# Altium project PM3_Bosclone.PrjPcb
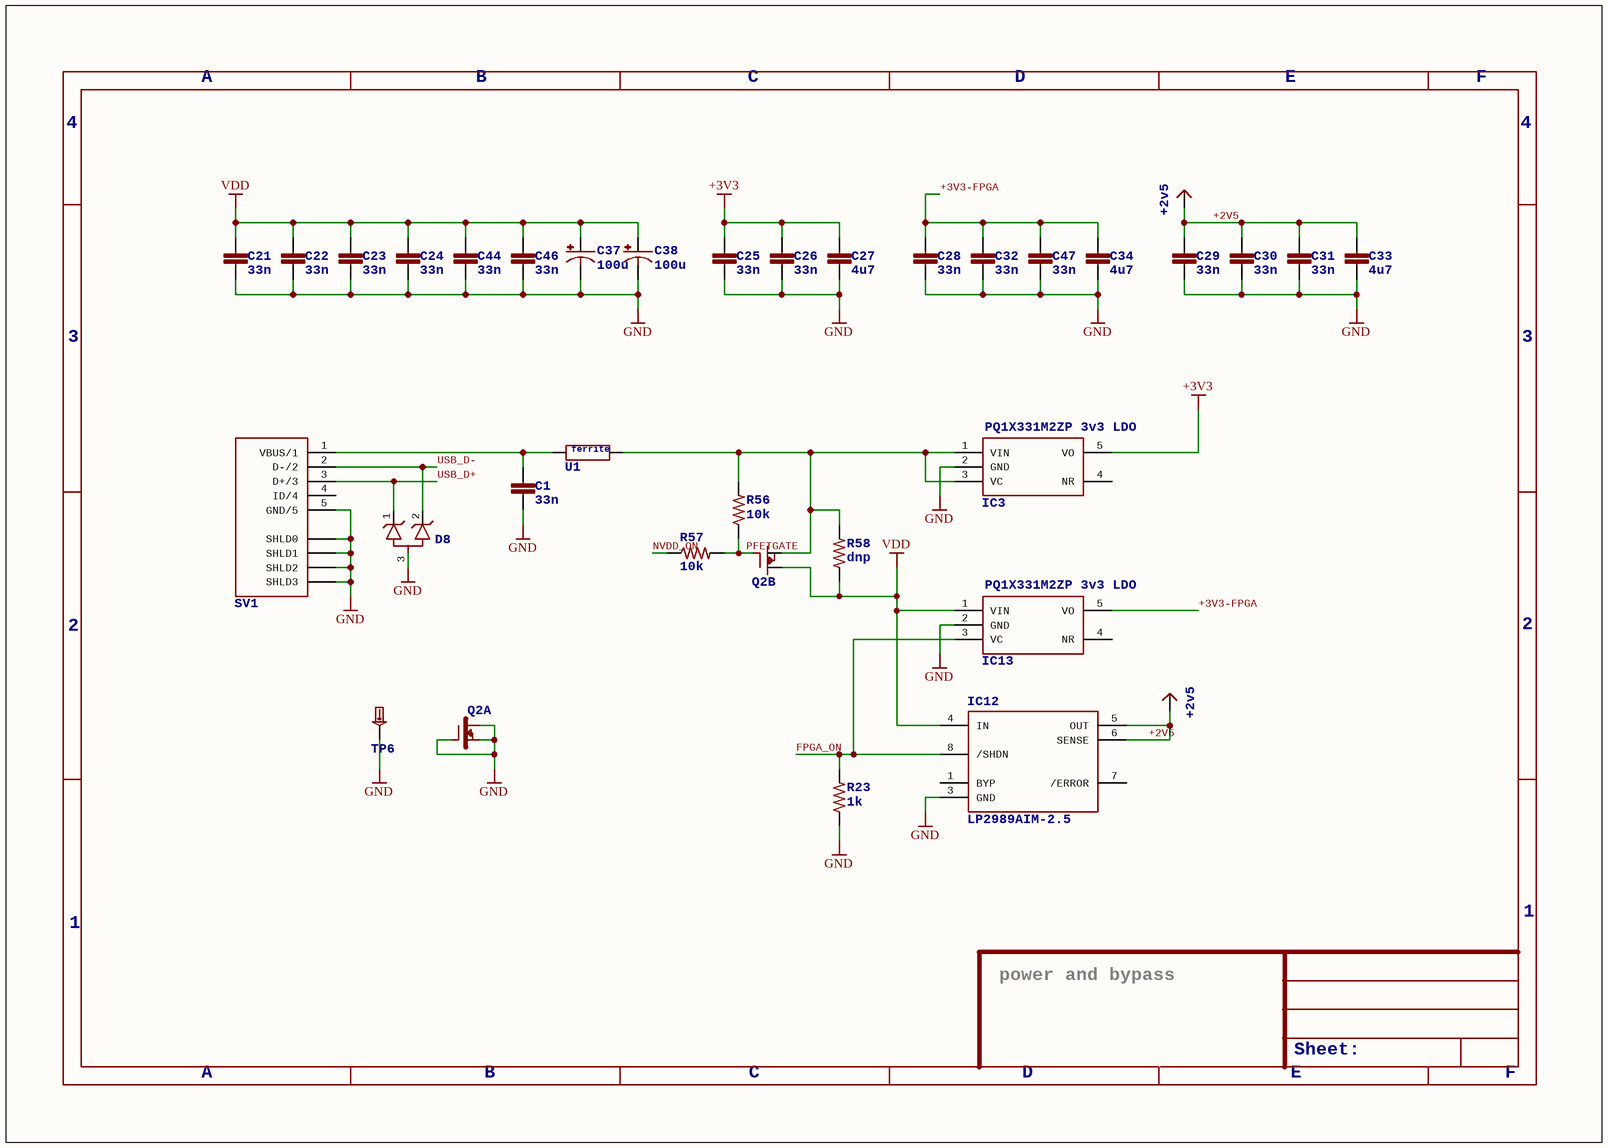
[diagram p0: PM3_Bosclone_PWR_0.SchDoc]
6 sheets, 160 parts. Net scope: global (net labels, ports and power ports of the same name join across sheets).
Board file: PM3_Boscloner.PcbDoc
Sheets:
  PM3_Bosclone_PWR_0.SchDoc
  PM3_Bosclone_FPGA_1.SchDoc
  PM3_Bosclone_MCU_2.SchDoc
  PM3_Bosclone_ANALOG_3.SchDoc
  PM3_Bosclone_ANALOG_TX_4.SchDoc
  PM3_Bosclone_Shield.SchDoc

## Sheet PM3_Bosclone_PWR_0.SchDoc
size 282 x 200 mm

### Parts
C1  33n  [RLC_0603]
C21  33n  [RLC_0603]
C22  33n  [RLC_0603]
C23  33n  [RLC_0603]
C24  33n  [RLC_0603]
C25  33n  [RLC_0603]
C26  33n  [RLC_0603]
C27  4u7  [RLC_1210]
C28  33n  [RLC_0603]
C29  33n  [RLC_0603]
C30  33n  [RLC_0603]
C31  33n  [RLC_0603]
C32  33n  [RLC_0603]
C33  4u7  [RLC_1210]
C34  4u7  [RLC_1210]
C37  100u  [CAPCAITOR-ELECTROLYTIC-ALCHIP-MZA-F80]
C38  100u  [CAPCAITOR-ELECTROLYTIC-ALCHIP-MZA-F80]
C44  33n  [RLC_0603]
C46  33n  [RLC_0603]
C47  33n  [RLC_0603]
D8  DUAL-TVS-COMMON-ANODE  [SOT23-3LEAD]  (value not drawn)
IC3  PQ1X331M2ZP3v3LDO: PQ1X331M2ZP 3v3 LDO  [SOT-23-5]  (hidden comment: PQ1X331M2ZP-3V3-LDO-SOT-23-5)
IC12  LP2989AIM-2.5  [SOIC-8]
IC13  PQ1X331M2ZP3v3LDO: PQ1X331M2ZP 3v3 LDO  [SOT-23-5]  (hidden comment: PQ1X331M2ZP-3V3-LDO-SOT-23-5)
Q2  IRF7307  [SOIC-8]  (value not drawn)  (parts A,B of 2)
R23  1k  [RLC_0603]
R56  10k  [RLC_0603]
R57  10k  [RLC_0603]
R58  dnp  [RLC_0603]
SV1  USB-MINIB  [USB-MINIB-SMD]  (value not drawn)
TP6  TESTPADKEYSTONE-PTH  [KEYSTONE-PTH-TESTPOINT-5011]  (value not drawn)
U1  FERRITE0805  [RLC_0805]  (value not drawn)
V31  SUPPLY_2V5  (value not drawn)
V37  SUPPLY_2V5  (value not drawn)

### Nets
+3V3: C25.1 C26.1 C27.1 IC3.5(VO)
GND: C1.2 C21.2 C22.2 C23.2 C24.2 C25.2 C26.2 C27.2 C28.2 C29.2 C30.2 C31.2 C32.2 C33.2 C34.2 C37.- C38.- C44.2 C46.2 C47.2 D8.3(A) IC3.2(GND) IC12.3(GND) IC13.2(GND) Q2.1(S) Q2.2(G) Q2.8(D) R23.1 SV1.5(GND/5) SV1.TAB0(SHLD0) SV1.TAB1(SHLD1) SV1.TAB2(SHLD2) SV1.TAB3(SHLD3) TP6.A(P$1)
VDD: C21.1 C22.1 C23.1 C24.1 C37.+ C38.+ C44.1 C46.1 IC12.4(IN) IC13.1(VIN) Q2.6(D) R58.1
+2V5: C29.1 C30.1 C31.1 C33.1 IC12.5(OUT) IC12.6(SENSE) V31.?1(+2V5) V37.?1(+2V5)
+3V3-FPGA: C28.1 C32.1 C34.1 C47.1 IC13.5(VO)
FPGA_ON: IC12.8(/SHDN) IC13.3(VC) R23.2
NVDD_ON: R57.1
PFETGATE: Q2.4(G) R56.1 R57.2
USB_D+: D8.1(K1) SV1.3(D+/3)
USB_D-: D8.2(K2) SV1.2(D-/2)
NetC1_1: C1.1 SV1.1(VBUS/1) U1.1(A)
NetIC3_1: IC3.1(VIN) IC3.3(VC) Q2.3(S) R56.2 R58.2 U1.2(B)

Not connected (* = marked no-connect by the designer): IC3 4(NR); IC12 1(BYP) 7(/ERROR); IC13 4(NR); SV1 4(ID/4)

### Notes on the sheet
- A
- B
- C
- D
- E
- F
- 4
- 3
- 2
- 1
- power and bypass
- Sheet:

### Library data of the parts
C1 C21-C26 C28-C32 C44 C46 C47 = CAPACITOR0603
C27 C33 C34 = CAPACITOR1210
C37 C38 = CAPACITOR-POLARIZEDALCHIP-MZA-F80
IC12 = LP2989-LDOSOIC
R23 R56-R58 = RESISTOR0603
U1 = FERRITE0805: ferrite: ferrite
V31 V37 = SUPPLY_2V5: +2v5: +2v5

## Sheet PM3_Bosclone_FPGA_1.SchDoc
size 282 x 200 mm
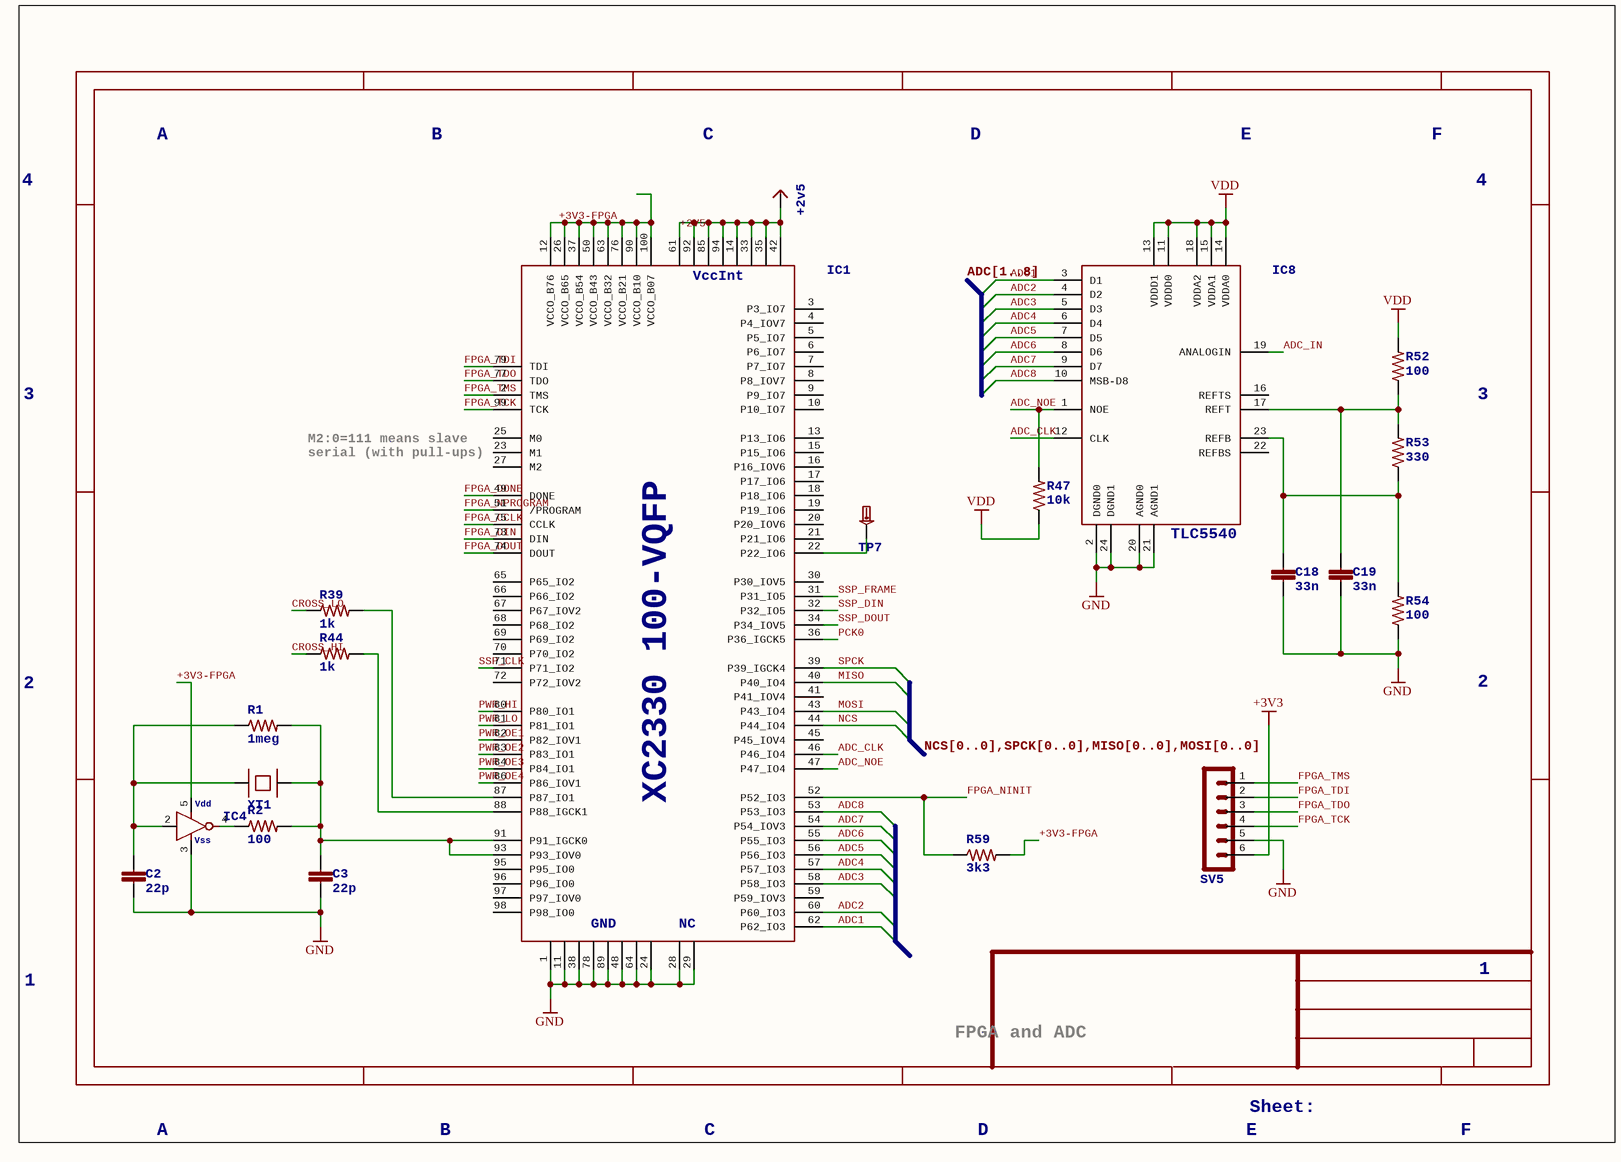
[diagram p1: PM3_Bosclone_FPGA_1.SchDoc]

### Parts
C2  22p  [RLC_0603]
C3  22p  [RLC_0603]
C18  33n  [RLC_0603]
C19  33n  [RLC_0603]
IC1  XC2330100-VQFP: XC2330 100-VQFP  [VQFP-100]  (hidden comment: SPARTAN-II-XC2S30-100-VQFP)
IC4  HCU-INVERTER  [SMV-5]  (value not drawn)
IC8  TLC5540  [TSSOP-24]
R1  1meg  [RLC_0603]
R2  100  [RLC_0603]
R39  1k  [RLC_0603]
R44  1k  [RLC_0603]
R47  10k  [RLC_0603]
R52  100  [RLC_0603]
R53  330  [RLC_0603]
R54  100  [RLC_0603]
R59  3k3  [RLC_0603]
SV5  HEADER-MALE-6X1  [HEADER-MALE-6X1-0.100-UNKEYED]  (value not drawn)
TP7  TESTPADKEYSTONE-SMD  [KEYSTONE-SMD-TESTPOINT-5015]  (value not drawn)
V4  SUPPLY_2V5  (value not drawn)
XT1  XTAL-SMD-CITIZEN-CS10  [XTAL-SMD-CITIZEN-CS10]  (value not drawn)

### Nets
+3V3: SV5.6
GND: C2.2 C3.2 C18.2 C19.2 IC1.1(GND1) IC1.11(GND2) IC1.24(GND8) IC1.28(NC0) IC1.29(NC1) IC1.38(GND3) IC1.48(GND6) IC1.64(GND7) IC1.78(GND4) IC1.89(GND5) IC4.3(VSS) IC8.2(DGND0) IC8.20(AGND0) IC8.21(AGND1) IC8.24(DGND1) R54.1 SV5.5
VDD: IC8.11(VDDD0) IC8.13(VDDD1) IC8.14(VDDA0) IC8.15(VDDA1) IC8.18(VDDA2) R47.1 R52.2
+2V5: IC1.14(VCCINT5) IC1.33(VCCINT6) IC1.35(VCCINT7) IC1.42(VCCINT8) IC1.61(VCCINT1) IC1.85(VCCINT3) IC1.92(VCCINT2) IC1.94(VCCINT4) V4.?1(+2V5)
+3V3-FPGA: IC1.12(VCCO_B76) IC1.26(VCCO_B65) IC1.37(VCCO_B54) IC1.50(VCCO_B43) IC1.63(VCCO_B32) IC1.76(VCCO_B21) IC1.90(VCCO_B10) IC1.100(VCCO_B07) IC4.5(VDD) R59.2
ADC1: IC1.62(P62_IO3) IC8.3(D1)
ADC2: IC1.60(P60_IO3) IC8.4(D2)
ADC3: IC1.58(P58_IO3) IC8.5(D3)
ADC4: IC1.57(P57_IO3) IC8.6(D4)
ADC5: IC1.56(P56_IO3) IC8.7(D5)
ADC6: IC1.55(P55_IO3) IC8.8(D6)
ADC7: IC1.54(P54_IOV3) IC8.9(D7)
ADC8: IC1.53(P53_IO3) IC8.10(MSB-D8)
ADC_CLK: IC1.46(P46_IO4) IC8.12(CLK)
ADC_IN: IC8.19(ANALOGIN)
ADC_NOE: IC1.47(P47_IO4) IC8.1(NOE) R47.2
CROSS_HI: R44.1
CROSS_LO: R39.1
FPGA_CCLK: IC1.75(CCLK)
FPGA_DIN: IC1.73(DIN)
FPGA_DONE: IC1.49(DONE)
FPGA_DOUT: IC1.74(DOUT)
FPGA_NINIT: IC1.52(P52_IO3) R59.1
FPGA_NPROGRAM: IC1.51(/PROGRAM)
FPGA_TCK: IC1.99(TCK) SV5.4
FPGA_TDI: IC1.79(TDI) SV5.2
FPGA_TDO: IC1.77(TDO) SV5.3
FPGA_TMS: IC1.2(TMS) SV5.1
MISO: IC1.40(P40_IO4)
MOSI: IC1.43(P43_IO4)
NCS: IC1.44(P44_IO4)
PCK0: IC1.36(P36_IGCK5)
PWR_HI: IC1.80(P80_IO1)
PWR_LO: IC1.81(P81_IO1)
PWR_OE1: IC1.82(P82_IOV1)
PWR_OE2: IC1.83(P83_IO1)
PWR_OE3: IC1.84(P84_IO1)
PWR_OE4: IC1.86(P86_IOV1)
SPCK: IC1.39(P39_IGCK4)
SSP_CLK: IC1.71(P71_IO2)
SSP_DIN: IC1.32(P32_IO5)
SSP_DOUT: IC1.34(P34_IOV5)
SSP_FRAME: IC1.31(P31_IO5)
NetC2_1: C2.1 IC4.2(A) R1.1 XT1.A
NetC3_1: C3.1 IC1.91(P91_IGCK0) IC1.93(P93_IOV0) R1.2 R2.2 XT1.B
NetC18_1: C18.1 IC8.23(REFB) R53.1 R54.2
NetC19_1: C19.1 IC8.17(REFT) R52.1 R53.2
NetIC1_22: IC1.22(P22_IO6) TP7.1(P$1)
NetIC1_87: IC1.87(P87_IO1) R39.2
NetIC1_88: IC1.88(P88_IGCK1) R44.2
NetIC4_4: IC4.4(Y) R2.1

Not connected (* = marked no-connect by the designer): IC1 3(P3_IO7) 4(P4_IOV7) 5(P5_IO7) 6(P6_IO7) 7(P7_IO7) 8(P8_IOV7) 9(P9_IO7) 10(P10_IO7) 13(P13_IO6) 15(P15_IO6) 16(P16_IOV6) 17(P17_IO6) 18(P18_IO6) 19(P19_IO6) 20(P20_IOV6) 21(P21_IO6) 23(M1) 25(M0) 27(M2) 30(P30_IOV5) 41(P41_IOV4) 45(P45_IOV4) 59(P59_IOV3) 65(P65_IO2) 66(P66_IO2) 67(P67_IOV2) 68(P68_IO2) 69(P69_IO2) 70(P70_IO2) 72(P72_IOV2) 95(P95_IO0) 96(P96_IO0) 97(P97_IOV0) 98(P98_IO0); IC8 16(REFTS) 22(REFBS)

### Buses and harness runs
bus ADC[1..8]
bus NCS[0..0],SPCK[0..0],MISO[0..0],MOSI[0..0]

### Notes on the sheet
- A
- B
- C
- D
- E
- F
- 4
- 3
- M2:0=111 means slave
- serial (with pull-ups)
- 2
- 1
- FPGA and ADC
- Sheet:

### Library data of the parts
C2 C3 C18 C19 = CAPACITOR0603
R1 R2 R39 R44 R47 R52-R54 R59 = RESISTOR0603
IC1 = SPARTAN-II-XC2S30-100-VQFP: VccInt: VccInt; GND: GND; NC: NC
IC4 = HCU-INVERTER: Vdd: Vdd; Vss: Vss
IC8 = TLC5540: TLC5540: TLC5540
V4 = SUPPLY_2V5: +2v5: +2v5

## Sheet PM3_Bosclone_MCU_2.SchDoc
size 282 x 200 mm
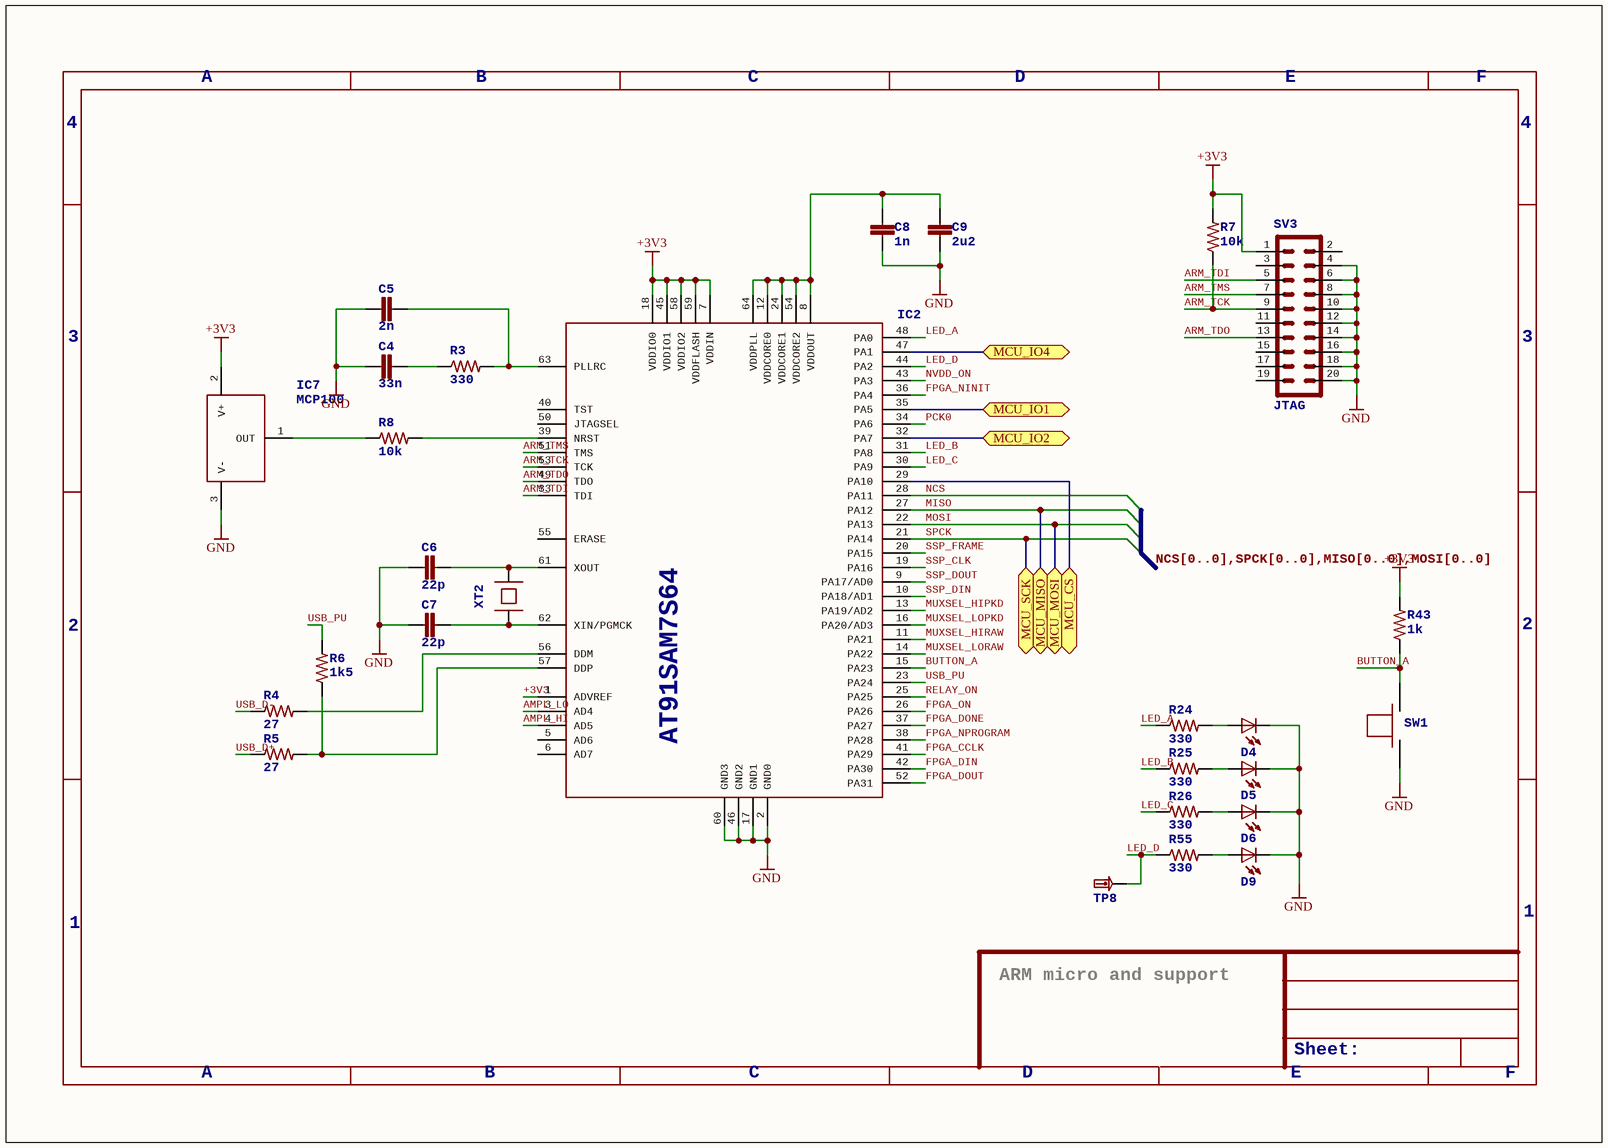
[diagram p2: PM3_Bosclone_MCU_2.SchDoc]

### Parts
C4  33n  [RLC_0603]
C5  2n  [RLC_0603]
C6  22p  [RLC_0603]
C7  22p  [RLC_0603]
C8  1n  [RLC_0603]
C9  2u2  [RLC_1210]
D4  LED  [LED_0603]  (value not drawn)
D5  LED  [LED_0603]  (value not drawn)
D6  LED  [LED_0603]  (value not drawn)
D9  LED  [LED_0603]  (value not drawn)
IC2  AT91SAM7S64  [LQFP-64]
IC7  MCP100  [SOT23-3LEAD]
R3  330  [RLC_0603]
R4  27  [RLC_0603]
R5  27  [RLC_0603]
R6  1k5  [RLC_0603]
R7  10k  [RLC_0603]
R8  10k  [RLC_0603]
R24  330  [RLC_0603]
R25  330  [RLC_0603]
R26  330  [RLC_0603]
R43  1k  [RLC_0603]
R55  330  [RLC_0603]
SV3  JTAG  [HEADER-MALE-10X2-0.100-SHROUDED]
SW1  TACTSWITCH  [TACTSWITCH-SMD-EVQQ1]  (value not drawn)
TP8  TESTPADKEYSTONE-SMD  [KEYSTONE-SMD-TESTPOINT-5015]  (value not drawn)
XT2  XTAL-SMD-CITIZEN-CS10  [XTAL-SMD-CITIZEN-CS10]  (value not drawn)

### Ports
MCU_CS, MCU_IO1, MCU_IO2, MCU_IO4, MCU_MISO, MCU_MOSI, MCU_SCK

### Nets
+3V3: IC2.1(ADVREF) IC2.7(VDDIN) IC2.18(VDDIO0) IC2.45(VDDIO1) IC2.58(VDDIO2) IC2.59(VDDFLASH) IC7.2(V+) R7.2 R43.2 SV3.1
GND: C4.1 C5.1 C6.1 C7.1 C8.2 C9.2 D4.-(C) D5.-(C) D6.-(C) D9.-(C) IC2.2(GND0) IC2.17(GND1) IC2.46(GND2) IC2.60(GND3) IC7.3(V-) SV3.4 SV3.6 SV3.8 SV3.10 SV3.12 SV3.14 SV3.16 SV3.18 SV3.20 SW1.A(P$1)
AMPL_HI: IC2.4(AD5)
AMPL_LO: IC2.3(AD4)
ARM_TCK: IC2.53(TCK) R7.1 SV3.9
ARM_TDI: IC2.33(TDI) SV3.5
ARM_TDO: IC2.49(TDO) SV3.13
ARM_TMS: IC2.51(TMS) SV3.7
BUTTON_A: IC2.15(PA23) R43.1 SW1.B(P$2)
FPGA_CCLK: IC2.41(PA29)
FPGA_DIN: IC2.42(PA30)
FPGA_DONE: IC2.37(PA27)
FPGA_DOUT: IC2.52(PA31)
FPGA_NINIT: IC2.36(PA4)
FPGA_NPROGRAM: IC2.38(PA28)
FPGA_ON: IC2.26(PA26)
LED_A: IC2.48(PA0) R24.1
LED_B: IC2.31(PA8) R25.1
LED_C: IC2.30(PA9) R26.1
LED_D: IC2.44(PA2) R55.1 TP8.1(P$1)
MISO: IC2.27(PA12) ; port MCU_MISO
MOSI: IC2.22(PA13) ; port MCU_MOSI
MUXSEL_HIPKD: IC2.13(PA19/AD2)
MUXSEL_HIRAW: IC2.11(PA21)
MUXSEL_LOPKD: IC2.16(PA20/AD3)
MUXSEL_LORAW: IC2.14(PA22)
NCS: IC2.28(PA11)
NVDD_ON: IC2.43(PA3)
PCK0: IC2.34(PA6)
RELAY_ON: IC2.25(PA25)
SPCK: IC2.21(PA14) ; port MCU_SCK
SSP_CLK: IC2.19(PA16)
SSP_DIN: IC2.10(PA18/AD1)
SSP_DOUT: IC2.9(PA17/AD0)
SSP_FRAME: IC2.20(PA15)
USB_D+: R5.1
USB_D-: R4.1
USB_PU: IC2.23(PA24) R6.2
NetC4_2: C4.2 R3.1
NetC5_2: C5.2 IC2.63(PLLRC) R3.2
NetC6_2: C6.2 IC2.61(XOUT) XT2.B
NetC7_2: C7.2 IC2.62(XIN/PGMCK) XT2.A
NetC8_1: C8.1 C9.1 IC2.8(VDDOUT) IC2.12(VDDCORE0) IC2.24(VDDCORE1) IC2.54(VDDCORE2) IC2.64(VDDPLL)
NetD4_+: D4.+(A) R24.2
NetD5_+: D5.+(A) R25.2
NetD6_+: D6.+(A) R26.2
NetD9_+: D9.+(A) R55.2
NetIC2_29: IC2.29(PA10) ; port MCU_CS
NetIC2_32: IC2.32(PA7) ; port MCU_IO2
NetIC2_35: IC2.35(PA5) ; port MCU_IO1
NetIC2_39: IC2.39(NRST) R8.2
NetIC2_47: IC2.47(PA1) ; port MCU_IO4
NetIC2_56: IC2.56(DDM) R4.2
NetIC2_57: IC2.57(DDP) R5.2 R6.1
NetIC7_1: IC7.1(OUT) R8.1

Not connected (* = marked no-connect by the designer): IC2 5(AD6) 6(AD7) 40(TST) 50(JTAGSEL) 55(ERASE); SV3 2 3 11 15 17 19

### Buses and harness runs
bus NCS[0..0],SPCK[0..0],MISO[0..0],MOSI[0..0]

### Notes on the sheet
- A
- B
- C
- D
- E
- F
- 4
- 3
- 2
- 1
- ARM micro and support
- Sheet:

### Library data of the parts
C4-C8 = CAPACITOR0603
C9 = CAPACITOR1210
R3-R8 R24-R26 R43 R55 = RESISTOR0603
SV3 = HEADER-MALE-10X2
IC2 = AT91SAM7S64: AT91SAM7S64: AT91SAM7S64

## Sheet PM3_Bosclone_ANALOG_3.SchDoc
size 282 x 200 mm
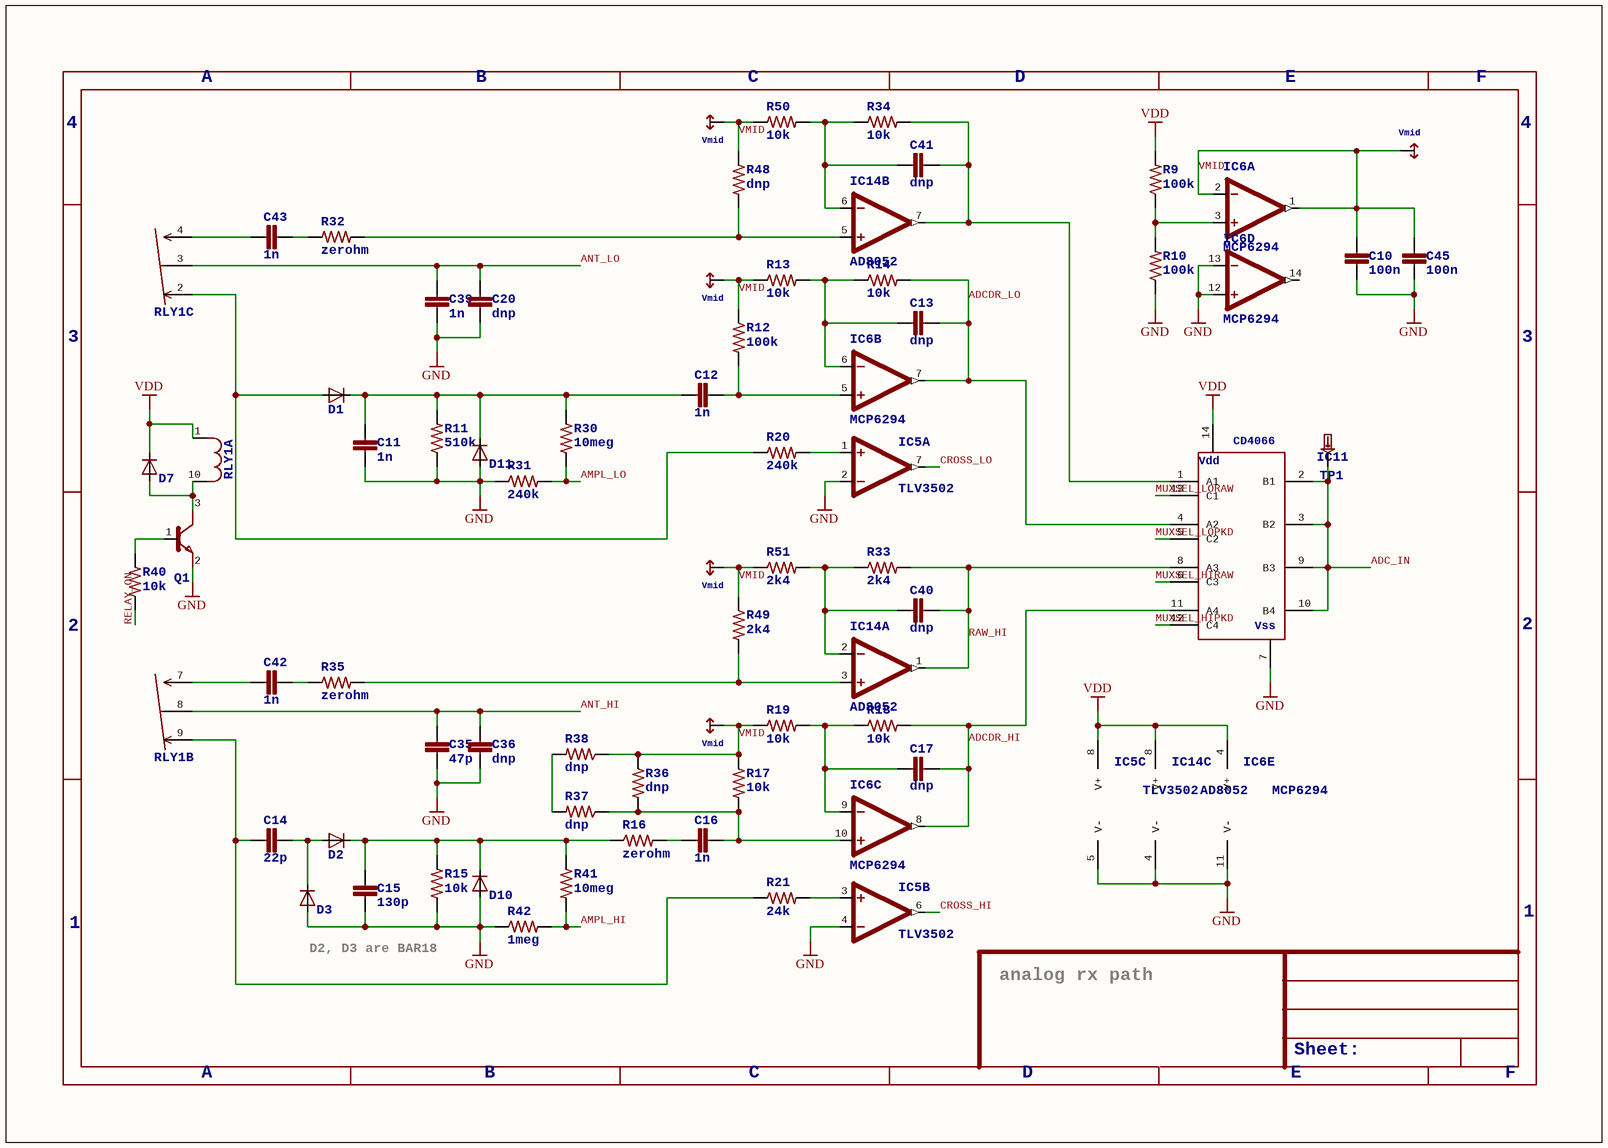
[diagram p3: PM3_Bosclone_ANALOG_3.SchDoc]

### Parts
C10  100n  [RLC_0603]
C11  1n  [RLC_0603]
C12  1n  [RLC_0603]
C13  dnp  [RLC_0603]
C14  22p  [RLC_0603]
C15  130p  [RLC_0603]
C16  1n  [RLC_0603]
C17  dnp  [RLC_0603]
C20  dnp  [RLC_0603]
C35  47p  [RLC_0603]
C36  dnp  [RLC_0603]
C39  1n  [RLC_0603]
C40  dnp  [RLC_0603]
C41  dnp  [RLC_0603]
C42  1n  [RLC_0603]
C43  1n  [RLC_0603]
C45  100n  [RLC_0603]
D1  DIODE-SMD-SOT23  [SOT23-3LEAD]  (value not drawn)
D2  DIODE-SMD-SOT23  [SOT23-3LEAD]  (value not drawn)
D3  DIODE-SMD-SOT23  [SOT23-3LEAD]  (value not drawn)
D7  DIODE-SMD-SOT23  [SOT23-3LEAD]  (value not drawn)
D10  DIODE-SMD-SOT23  [SOT23-3LEAD]  (value not drawn)
D11  DIODE-SMD-SOT23  [SOT23-3LEAD]  (value not drawn)
IC5  TLV3502  [SOT-23-8-OR-MSOP-8]  (parts A,B,C of 3)
IC6  MCP6294  [TSSOP-14]  (parts A,B,C,D,E of 5)
IC11  CD4066  [TSSOP-14]
IC14  AD8052  [MSOP8]  (parts A,B,C of 3)
Q1  NPN-SOT23-2N3904  [SOT23-3LEAD]  (value not drawn)
R9  100k  [RLC_0603]
R10  100k  [RLC_0603]
R11  510k  [RLC_0603]
R12  100k  [RLC_0603]
R13  10k  [RLC_0603]
R14  10k  [RLC_0603]
R15  10k  [RLC_0603]
R16  zerohm  [RLC_0603]
R17  10k  [RLC_0603]
R18  10k  [RLC_0603]
R19  10k  [RLC_0603]
R20  240k  [RLC_0603]
R21  24k  [RLC_0603]
R30  10meg  [RLC_0603]
R31  240k  [RLC_0603]
R32  zerohm  [RLC_0603]
R33  2k4  [RLC_0603]
R34  10k  [RLC_0603]
R35  zerohm  [RLC_0603]
R36  dnp  [RLC_0603]
R37  dnp  [RLC_0603]
R38  dnp  [RLC_0603]
R40  10k  [RLC_0603]
R41  10meg  [RLC_0603]
R42  1meg  [RLC_0603]
R48  dnp  [RLC_0603]
R49  2k4  [RLC_0603]
R50  10k  [RLC_0603]
R51  2k4  [RLC_0603]
RLY1  RELAY-DPDT  [TQ-SMD-RELAY]  (value not drawn)  (parts A,B,C of 3)
TP1  TESTPADKEYSTONE-SMD  [KEYSTONE-SMD-TESTPOINT-5015]  (value not drawn)
V13  SUPPLY_VMID  (value not drawn)
V17  SUPPLY_VMID  (value not drawn)
V21  SUPPLY_VMID  (value not drawn)
V52  SUPPLY_VMID  (value not drawn)
V53  SUPPLY_VMID  (value not drawn)

### Nets
GND: C10.2 C11.2 C15.2 C20.2 C35.2 C36.2 C39.2 C45.2 D3.1(A) D10.1(A) D11.1(A) IC5.2(-IN) IC5.4(-IN) IC5.5(V-) IC6.11(V-) IC6.12(+IN) IC6.13(-IN) IC11.7(VSS) IC14.4(V-) Q1.2(E) R10.1 R11.1 R15.1 R31.1 R42.1
VDD: D7.3(C) IC5.8(V+) IC6.4(V+) IC11.14(VDD) IC14.8(V+) R9.2 RLY1.1(P$1)
ADC_IN: IC11.2(B1) IC11.3(B2) IC11.9(B3) IC11.10(B4) TP1.1(P$1)
ADCDR_HI: C17.2 IC6.8(OUT) IC11.11(A4) R18.2
ADCDR_LO: C13.2 IC6.7(OUT) IC11.4(A2) R14.2
AMPL_HI: R41.2 R42.2
AMPL_LO: R30.2 R31.2
ANT_HI: C35.1 C36.1 RLY1.8(COM)
ANT_LO: C20.1 C39.1 RLY1.3(COM)
CROSS_HI: IC5.6(OUT)
CROSS_LO: IC5.7(OUT)
MUXSEL_HIPKD: IC11.12(C4)
MUXSEL_HIRAW: IC11.6(C3)
MUXSEL_LOPKD: IC11.5(C2)
MUXSEL_LORAW: IC11.13(C1)
RAW_HI: C40.2 IC11.8(A3) IC14.1(OUT) R33.2
RELAY_ON: R40.1
VMID: C10.1 C45.1 IC6.1(OUT) IC6.2(-IN) R12.1 R13.1 R17.1 R19.1 R36.1 R38.1 R48.1 R49.1 R50.1 R51.1 V13.?1(VMID) V17.?1(VMID) V21.?1(VMID) V52.?1(VMID) V53.?1(VMID)
NetC11_1: C11.1 C12.1 D1.3(C) D11.3(C) R11.2 R30.1
NetC12_2: C12.2 IC6.5(+IN) R12.2
NetC13_1: C13.1 IC6.6(-IN) R13.2 R14.1
NetC14_1: C14.1 R21.1 RLY1.9(NC)
NetC14_2: C14.2 D2.1(A) D3.3(C)
NetC15_1: C15.1 D2.3(C) D10.3(C) R15.2 R16.1 R41.1
NetC16_1: C16.1 R16.2
NetC16_2: C16.2 IC6.10(+IN) R17.2 R36.2 R37.1
NetC17_1: C17.1 IC6.9(-IN) R18.1 R19.2
NetC40_1: C40.1 IC14.2(-IN) R33.1 R51.2
NetC41_1: C41.1 IC14.6(-IN) R34.1 R50.2
NetC41_2: C41.2 IC11.1(A1) IC14.7(OUT) R34.2
NetC42_1: C42.1 RLY1.7(NO)
NetC42_2: C42.2 R35.1
NetC43_1: C43.1 RLY1.4(NO)
NetC43_2: C43.2 R32.1
NetD1_1: D1.1(A) R20.1 RLY1.2(NC)
NetD7_1: D7.1(A) Q1.3(C) RLY1.10(P$2)
NetIC5_1: IC5.1(+IN) R20.2
NetIC5_3: IC5.3(+IN) R21.2
NetIC6_3: IC6.3(+IN) R9.1 R10.2
NetIC14_3: IC14.3(+IN) R35.2 R49.2
NetIC14_5: IC14.5(+IN) R32.2 R48.2
NetQ1_1: Q1.1(B) R40.2
NetR37_2: R37.2 R38.2

Not connected (* = marked no-connect by the designer): IC6 14(OUT)

### Notes on the sheet
- A
- B
- C
- D
- E
- F
- 4
- 3
- 2
- 1
- D2, D3 are BAR18
- analog rx path
- Sheet:

### Library data of the parts
C10-C17 C20 C35 C36 C39-C43 C45 = CAPACITOR0603
IC5 = COMP-TLV3502SOT-23-8-OR-MSOP-8
IC6 = OPAMP-TLC2274
IC14 = OPAMP-AD8052
R9-R21 R30-R38 R40-R42 R48-R51 = RESISTOR0603
IC11 = CD4066: Vss: Vss; Vdd: Vdd; CD4066: CD4066
V13 V17 V21 V52 V53 = SUPPLY_VMID: Vmid: Vmid

## Sheet PM3_Bosclone_ANALOG_TX_4.SchDoc
size 282 x 200 mm
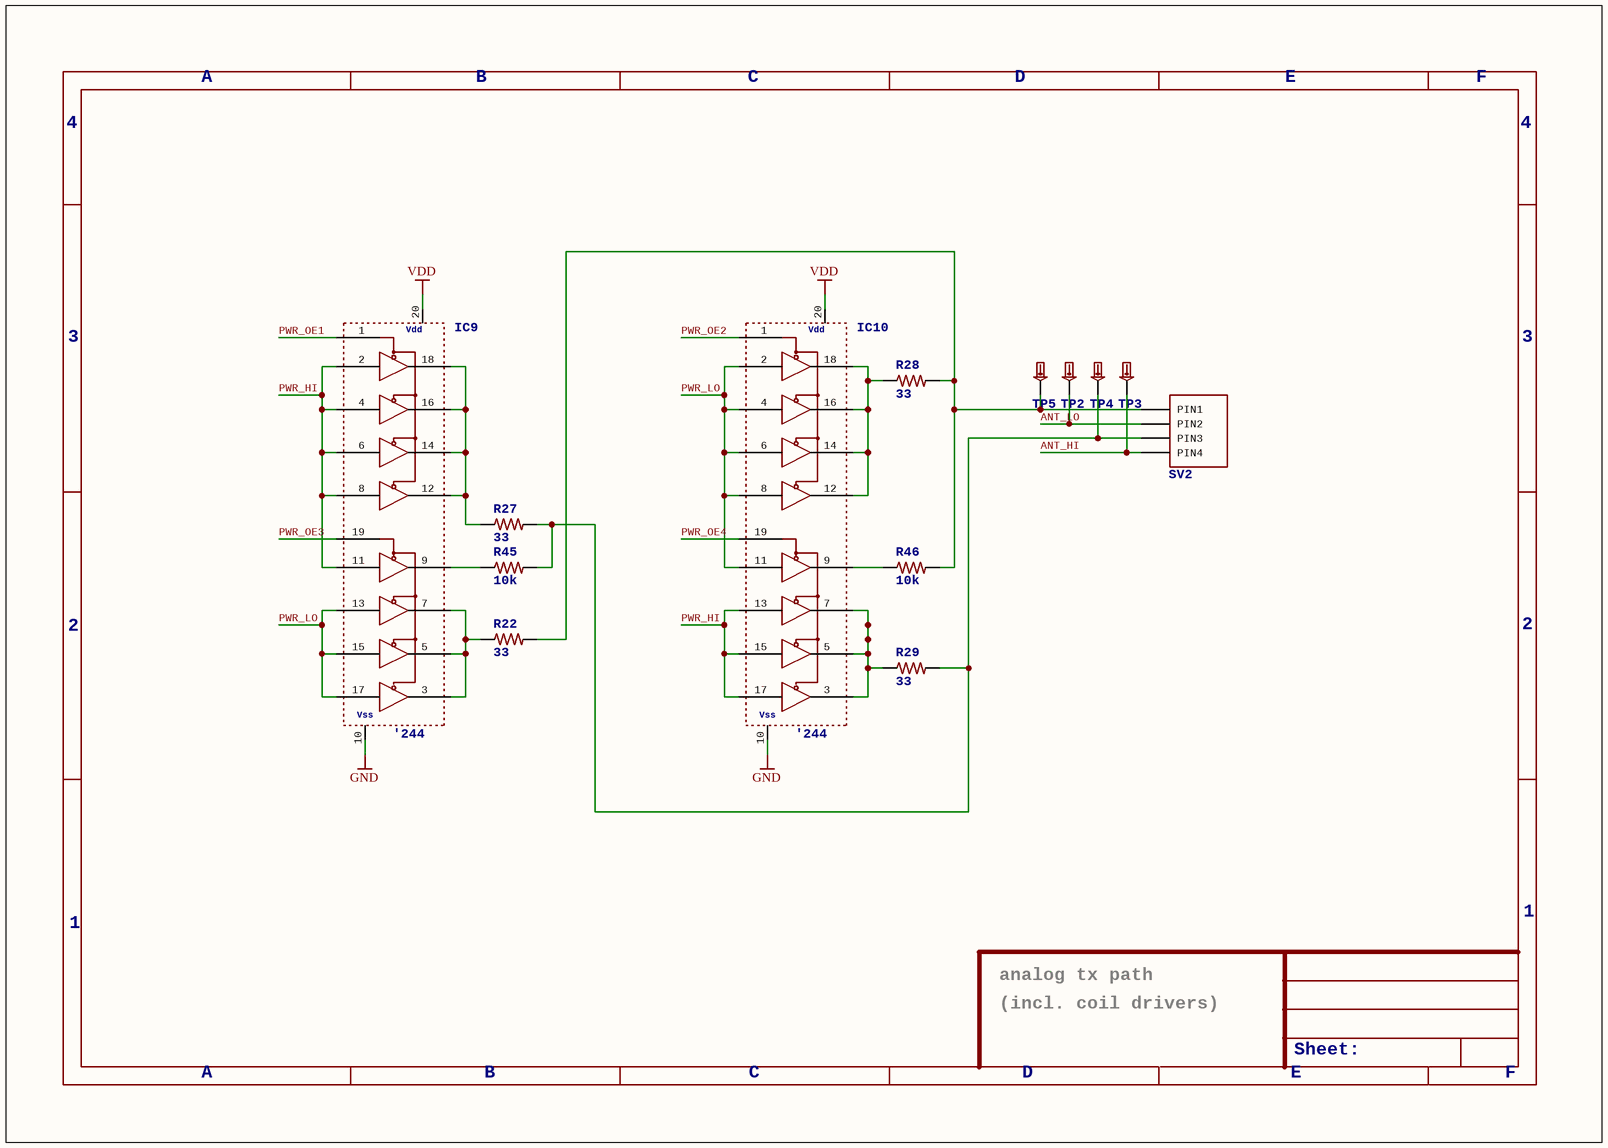
[diagram p4: PM3_Bosclone_ANALOG_TX_4.SchDoc]

### Parts
IC9  74XX244-OCTAL-TRISTATE-BUFFERS  [TSSOP-20-extended]  (value not drawn)
IC10  74XX244-OCTAL-TRISTATE-BUFFERS  [TSSOP-20-extended]  (value not drawn)
R22  33  [RLC_0603]
R27  33  [RLC_0603]
R28  33  [RLC_0603]
R29  33  [RLC_0603]
R45  10k  [RLC_0603]
R46  10k  [RLC_0603]
SV2  HIROSE-MQ172-4POS  [HIROSE-MQ172-4POS]  (value not drawn)
TP2  TESTPADKEYSTONE-SMD  [KEYSTONE-SMD-TESTPOINT-5015]  (value not drawn)
TP3  TESTPADKEYSTONE-SMD  [KEYSTONE-SMD-TESTPOINT-5015]  (value not drawn)
TP4  TESTPADKEYSTONE-SMD  [KEYSTONE-SMD-TESTPOINT-5015]  (value not drawn)
TP5  TESTPADKEYSTONE-SMD  [KEYSTONE-SMD-TESTPOINT-5015]  (value not drawn)

### Nets
GND: IC9.10(VSS) IC10.10(VSS)
VDD: IC9.20(VDD) IC10.20(VDD)
ANT_HI: SV2.4(PIN4) TP3.1(P$1)
ANT_LO: SV2.2(PIN2) TP2.1(P$1)
PWR_HI: IC9.2(1A1) IC9.4(1A2) IC9.6(1A3) IC9.8(1A4) IC9.11(2A1) IC10.13(2A2) IC10.15(2A3) IC10.17(2A4)
PWR_LO: IC9.13(2A2) IC9.15(2A3) IC9.17(2A4) IC10.2(1A1) IC10.4(1A2) IC10.6(1A3) IC10.8(1A4) IC10.11(2A1)
PWR_OE1: IC9.1(1NOE)
PWR_OE2: IC10.1(1NOE)
PWR_OE3: IC9.19(2NOE)
PWR_OE4: IC10.19(2NOE)
NetIC9_3: IC9.3(2Y4) IC9.5(2Y3) IC9.7(2Y2) R22.1
NetIC9_9: IC9.9(2Y1) R45.1
NetIC9_12: IC9.12(1Y4) IC9.14(1Y3) IC9.16(1Y2) IC9.18(1Y1) R27.1
NetIC10_3: IC10.3(2Y4) IC10.5(2Y3) IC10.7(2Y2) R29.1
NetIC10_9: IC10.9(2Y1) R46.1
NetIC10_12: IC10.12(1Y4) IC10.14(1Y3) IC10.16(1Y2) IC10.18(1Y1) R28.1
NetR22_2: R22.2 R28.2 R46.2 SV2.1(PIN1) TP5.1(P$1)
NetR27_2: R27.2 R29.2 R45.2 SV2.3(PIN3) TP4.1(P$1)

### Notes on the sheet
- A
- B
- C
- D
- E
- F
- 4
- 3
- 2
- 1
- analog tx path
- (incl. coil drivers)
- Sheet:

### Library data of the parts
R22 R27-R29 R45 R46 = RESISTOR0603
IC9 IC10 = 74XX244-OCTAL-TRISTATE-BUFFERS: '244: '244; Vdd: Vdd; Vss: Vss

## Sheet PM3_Bosclone_Shield.SchDoc
size A
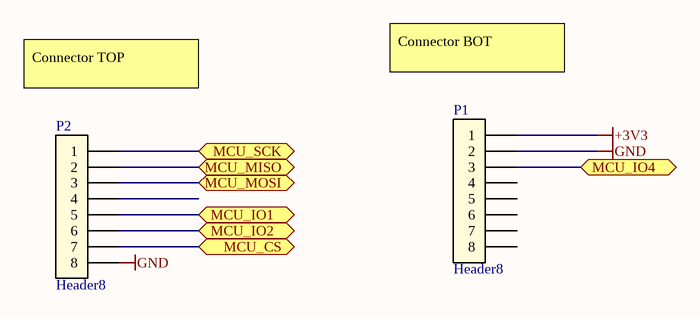
[diagram p5: PM3_Bosclone_Shield.SchDoc]

### Parts
P1  Header8  [HEADER_8_40_100THRU SIP]
P2  Header8  [HEADER_8_40_100THRU SIP]

### Ports
MCU_CS, MCU_IO1, MCU_IO2, MCU_IO4, MCU_MISO, MCU_MOSI, MCU_SCK

### Nets
+3V3: P1.1
GND: P1.2 P2.8
MISO: P2.2 ; port MCU_MISO
MOSI: P2.3 ; port MCU_MOSI
SPCK: P2.1 ; port MCU_SCK
NetIC2_29: P2.7 ; port MCU_CS
NetIC2_32: P2.6 ; port MCU_IO2
NetIC2_35: P2.5 ; port MCU_IO1
NetIC2_47: P1.3 ; port MCU_IO4

Not connected (* = marked no-connect by the designer): P1 4 5 6 7 8; P2 4

### Notes on the sheet
- Connector TOP
- Connector BOT

### Library data of the parts
P1 P2 = Header8: Header 8 pin

## Nets that join several sheets
+3V3: PM3_Bosclone_PWR_0 (C25.1 C26.1 C27.1 IC3.5), PM3_Bosclone_FPGA_1 (SV5.6), PM3_Bosclone_MCU_2 (10 pins), PM3_Bosclone_Shield (P1.1)
GND: PM3_Bosclone_PWR_0 (34 pins), PM3_Bosclone_FPGA_1 (21 pins), PM3_Bosclone_MCU_2 (25 pins), PM3_Bosclone_ANALOG_3 (25 pins), PM3_Bosclone_ANALOG_TX_4 (IC9.10 IC10.10), PM3_Bosclone_Shield (P1.2 P2.8)
VDD: PM3_Bosclone_PWR_0 (12 pins), PM3_Bosclone_FPGA_1 (7 pins), PM3_Bosclone_ANALOG_3 (7 pins), PM3_Bosclone_ANALOG_TX_4 (IC9.20 IC10.20)
+2V5: PM3_Bosclone_PWR_0 (8 pins), PM3_Bosclone_FPGA_1 (9 pins)
+3V3-FPGA: PM3_Bosclone_PWR_0 (5 pins), PM3_Bosclone_FPGA_1 (10 pins)
ADC_IN: PM3_Bosclone_FPGA_1 (IC8.19), PM3_Bosclone_ANALOG_3 (5 pins)
AMPL_HI: PM3_Bosclone_MCU_2 (IC2.4), PM3_Bosclone_ANALOG_3 (R41.2 R42.2)
AMPL_LO: PM3_Bosclone_MCU_2 (IC2.3), PM3_Bosclone_ANALOG_3 (R30.2 R31.2)
ANT_HI: PM3_Bosclone_ANALOG_3 (C35.1 C36.1 RLY1.8), PM3_Bosclone_ANALOG_TX_4 (SV2.4 TP3.1)
ANT_LO: PM3_Bosclone_ANALOG_3 (C20.1 C39.1 RLY1.3), PM3_Bosclone_ANALOG_TX_4 (SV2.2 TP2.1)
CROSS_HI: PM3_Bosclone_FPGA_1 (R44.1), PM3_Bosclone_ANALOG_3 (IC5.6)
CROSS_LO: PM3_Bosclone_FPGA_1 (R39.1), PM3_Bosclone_ANALOG_3 (IC5.7)
FPGA_CCLK: PM3_Bosclone_FPGA_1 (IC1.75), PM3_Bosclone_MCU_2 (IC2.41)
FPGA_DIN: PM3_Bosclone_FPGA_1 (IC1.73), PM3_Bosclone_MCU_2 (IC2.42)
FPGA_DONE: PM3_Bosclone_FPGA_1 (IC1.49), PM3_Bosclone_MCU_2 (IC2.37)
FPGA_DOUT: PM3_Bosclone_FPGA_1 (IC1.74), PM3_Bosclone_MCU_2 (IC2.52)
FPGA_NINIT: PM3_Bosclone_FPGA_1 (IC1.52 R59.1), PM3_Bosclone_MCU_2 (IC2.36)
FPGA_NPROGRAM: PM3_Bosclone_FPGA_1 (IC1.51), PM3_Bosclone_MCU_2 (IC2.38)
FPGA_ON: PM3_Bosclone_PWR_0 (IC12.8 IC13.3 R23.2), PM3_Bosclone_MCU_2 (IC2.26)
MISO: PM3_Bosclone_FPGA_1 (IC1.40), PM3_Bosclone_MCU_2 (IC2.27), PM3_Bosclone_Shield (P2.2)
MOSI: PM3_Bosclone_FPGA_1 (IC1.43), PM3_Bosclone_MCU_2 (IC2.22), PM3_Bosclone_Shield (P2.3)
MUXSEL_HIPKD: PM3_Bosclone_MCU_2 (IC2.13), PM3_Bosclone_ANALOG_3 (IC11.12)
MUXSEL_HIRAW: PM3_Bosclone_MCU_2 (IC2.11), PM3_Bosclone_ANALOG_3 (IC11.6)
MUXSEL_LOPKD: PM3_Bosclone_MCU_2 (IC2.16), PM3_Bosclone_ANALOG_3 (IC11.5)
MUXSEL_LORAW: PM3_Bosclone_MCU_2 (IC2.14), PM3_Bosclone_ANALOG_3 (IC11.13)
NCS: PM3_Bosclone_FPGA_1 (IC1.44), PM3_Bosclone_MCU_2 (IC2.28)
NetIC2_29: PM3_Bosclone_MCU_2 (IC2.29), PM3_Bosclone_Shield (P2.7)
NetIC2_32: PM3_Bosclone_MCU_2 (IC2.32), PM3_Bosclone_Shield (P2.6)
NetIC2_35: PM3_Bosclone_MCU_2 (IC2.35), PM3_Bosclone_Shield (P2.5)
NetIC2_47: PM3_Bosclone_MCU_2 (IC2.47), PM3_Bosclone_Shield (P1.3)
NVDD_ON: PM3_Bosclone_PWR_0 (R57.1), PM3_Bosclone_MCU_2 (IC2.43)
PCK0: PM3_Bosclone_FPGA_1 (IC1.36), PM3_Bosclone_MCU_2 (IC2.34)
PWR_HI: PM3_Bosclone_FPGA_1 (IC1.80), PM3_Bosclone_ANALOG_TX_4 (8 pins)
PWR_LO: PM3_Bosclone_FPGA_1 (IC1.81), PM3_Bosclone_ANALOG_TX_4 (8 pins)
PWR_OE1: PM3_Bosclone_FPGA_1 (IC1.82), PM3_Bosclone_ANALOG_TX_4 (IC9.1)
PWR_OE2: PM3_Bosclone_FPGA_1 (IC1.83), PM3_Bosclone_ANALOG_TX_4 (IC10.1)
PWR_OE3: PM3_Bosclone_FPGA_1 (IC1.84), PM3_Bosclone_ANALOG_TX_4 (IC9.19)
PWR_OE4: PM3_Bosclone_FPGA_1 (IC1.86), PM3_Bosclone_ANALOG_TX_4 (IC10.19)
RELAY_ON: PM3_Bosclone_MCU_2 (IC2.25), PM3_Bosclone_ANALOG_3 (R40.1)
SPCK: PM3_Bosclone_FPGA_1 (IC1.39), PM3_Bosclone_MCU_2 (IC2.21), PM3_Bosclone_Shield (P2.1)
SSP_CLK: PM3_Bosclone_FPGA_1 (IC1.71), PM3_Bosclone_MCU_2 (IC2.19)
SSP_DIN: PM3_Bosclone_FPGA_1 (IC1.32), PM3_Bosclone_MCU_2 (IC2.10)
SSP_DOUT: PM3_Bosclone_FPGA_1 (IC1.34), PM3_Bosclone_MCU_2 (IC2.9)
SSP_FRAME: PM3_Bosclone_FPGA_1 (IC1.31), PM3_Bosclone_MCU_2 (IC2.20)
USB_D+: PM3_Bosclone_PWR_0 (D8.1 SV1.3), PM3_Bosclone_MCU_2 (R5.1)
USB_D-: PM3_Bosclone_PWR_0 (D8.2 SV1.2), PM3_Bosclone_MCU_2 (R4.1)